# EAGLE design BSB-to-Wifi (EAGLE 6.6.0)
REVISION: v1.1

## Sheet 1 of 3
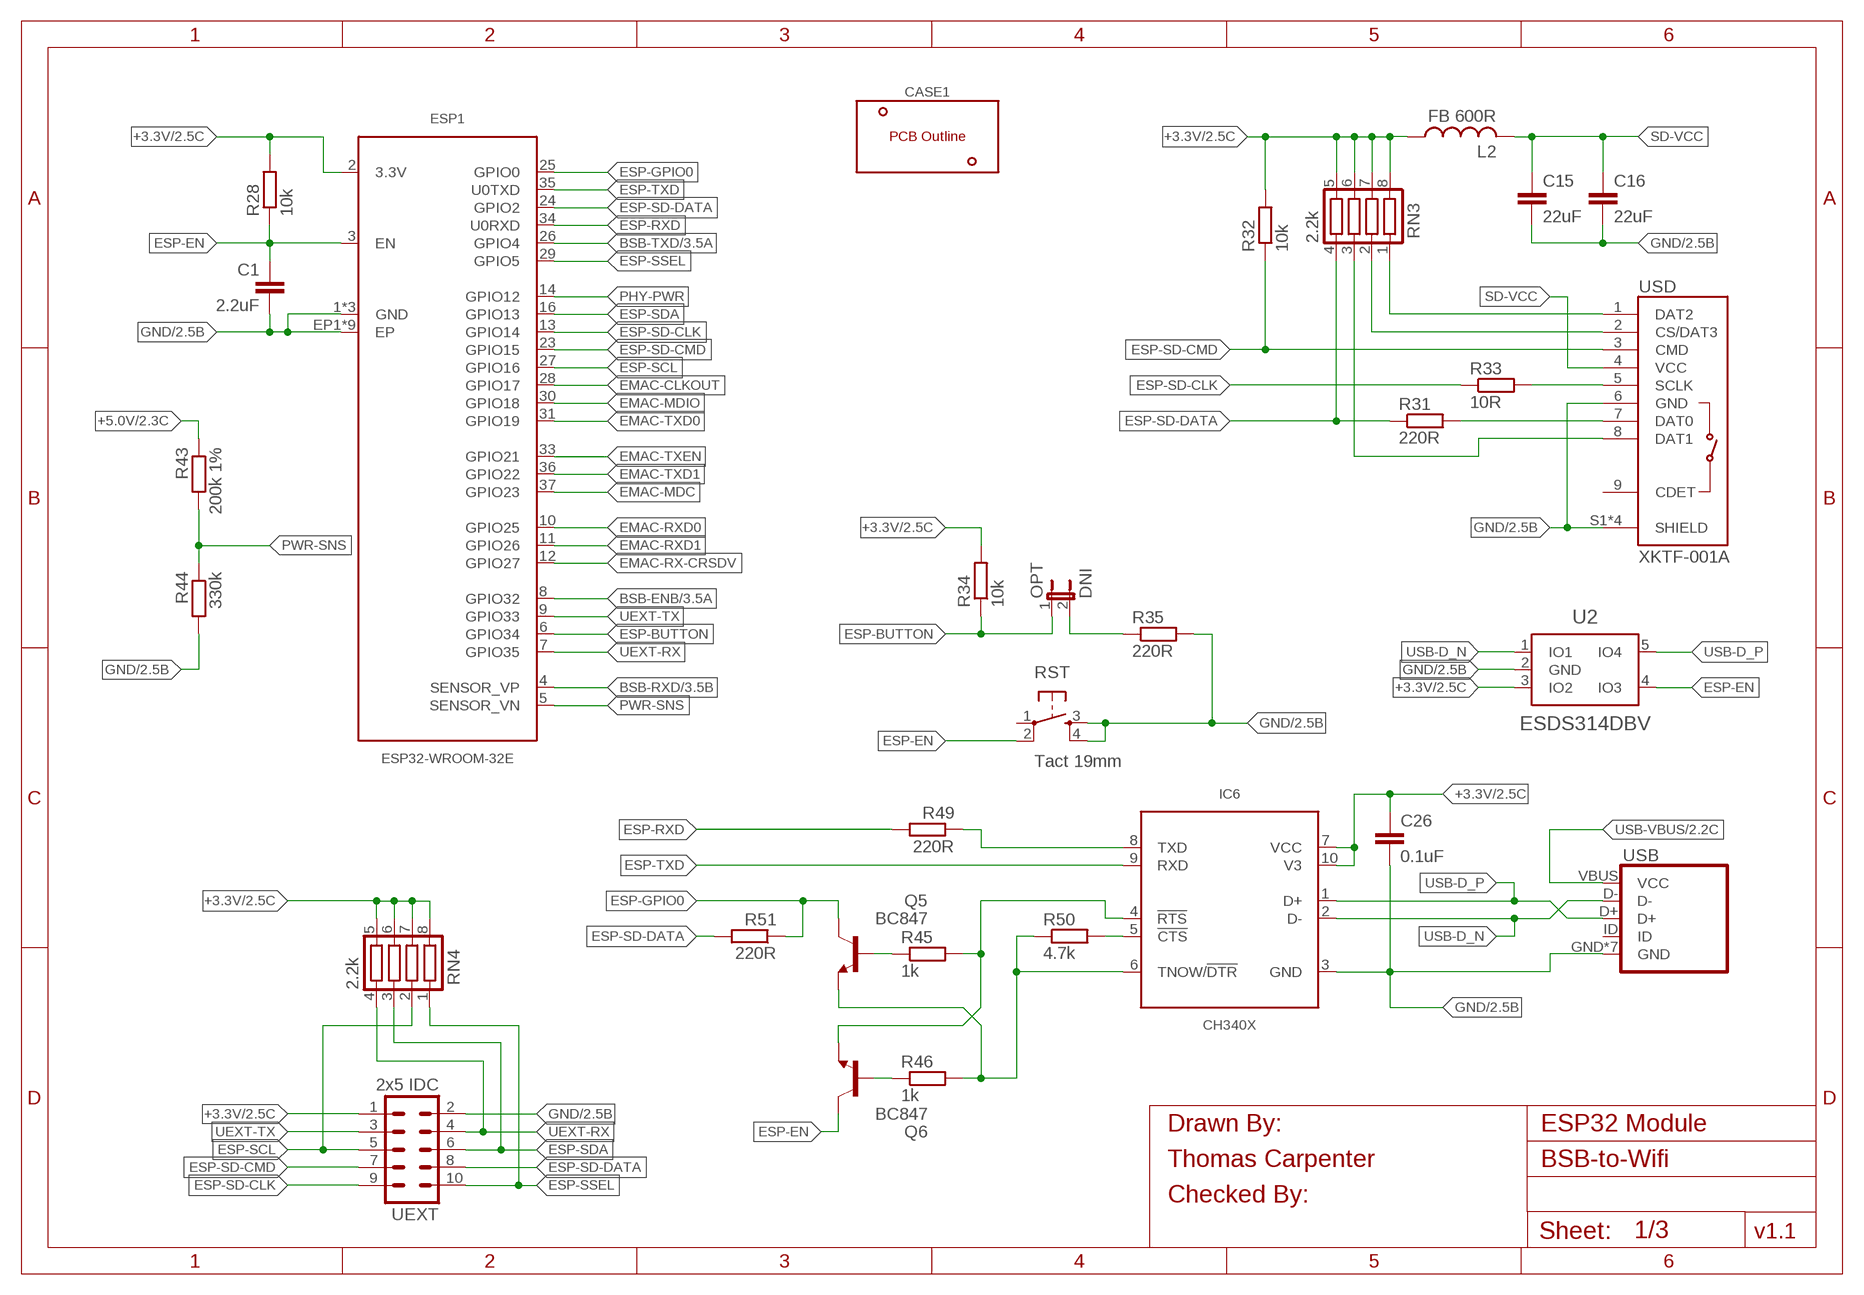
[diagram p0: schematic, sheet 1]
FRAME4 (A4L-LOC): DRAWN_BY: Thomas Carpenter; SHEET_NAME: ESP32 Module

### Parts
C1  2.2uF  C-EUC0603  [C0603]
C15  22uF  C-EUC0805L  [C0805L]
C16  22uF  C-EUC0805L  [C0805L]
C26  0.1uF  C-EUC0402  [C0402]
CASE1  DNI  CNMB/2  [CNMB/2-]
ESP1  ESP32-WROOM-32E  [ESP32-WROOM-32E]
IC6  CH340X  [MSOP10]
L2  FB 600R  L-USL0805  [L2010]
OPT  DNI  JUMPER-2-PTH  [1X02]
Q5  BC847  [SOT23]
Q6  BC847  [SOT23]
R28  10k  R-EU_R0402  [R0402]
R31  220R  R-EU_R0402  [R0402]
R32  10k  R-EU_R0402  [R0402]
R33  10R  R-EU_R0603L  [R0603L]
R34  10k  R-EU_R0402  [R0402]
R35  220R  R-EU_R0402  [R0402]
R43  200k 1%  R-EU_R0402  [R0402]
R44  330k  R-EU_R0603L  [R0603L]
R45  1k  R-EU_R0402  [R0402]
R46  1k  R-EU_R0402  [R0402]
R49  220R  R-EU_R0402  [R0402]
R50  4.7k  R-EU_R0402  [R0402]
R51  220R  R-EU_R0402  [R0402]
RN3  2.2k  R-NET-04-R1206  [CTS742C083]
RN4  2.2k  R-NET-04-R1206  [CTS742C083]
RST  Tact 19mm  SWITCH-MOMENTARY  [TACTILE_SWITCH]
U2  ESDS314DBV  [DBV0005A-SOT23]
UEXT  2x5 IDC  ML10  [ML10]
USB  ZX62-B-5PA(33)  USB_MICROB_PLUG  [USB-MICROB]
USD  XKTF-001A  MICROSD  [MICRO-SD]

### Nets
+3.3V [ESP32]: C26.1 ESP1.2(3.3V) IC6.7(VCC) IC6.10(V3) L2.1 R28.2 R32.2 R34.2 RN3.5 RN3.6 RN3.7 RN3.8 RN4.5 RN4.6 RN4.7 RN4.8 U2.3(IO2) UEXT.1 ; also sheet 2,3
+5.0V [ESP32]: R43.1 ; also sheet 2
BSB-ENB: ESP1.8(GPIO32) ; also sheet 3
BSB-RXD [ESP32]: ESP1.4(SENSOR_VP) ; also sheet 3
BSB-TXD [ESP32]: ESP1.26(GPIO4) ; also sheet 3
CH340-!CTS [ESP32]: IC6.5(!CTS) R50.2
CH340-!DTR [ESP32]: IC6.6(TNOW/!DTR) Q5.2(E) R46.2 R50.1
CH340-!RTS [ESP32]: IC6.4(!RTS) Q6.2(E) R45.2
CH340-TXD [ESP32]: IC6.8(TXD) R49.1
EMAC-CLKOUT [ESP32]: ESP1.28(GPIO17)
EMAC-MDC [ESP32]: ESP1.37(GPIO23)
EMAC-MDIO [ESP32]: ESP1.30(GPIO18)
EMAC-RX-CRSDV [ESP32]: ESP1.12(GPIO27)
EMAC-RXD0 [ESP32]: ESP1.10(GPIO25)
EMAC-RXD1 [ESP32]: ESP1.11(GPIO26)
EMAC-TXD0 [ESP32]: ESP1.31(GPIO19)
EMAC-TXD1 [ESP32]: ESP1.36(GPIO22)
EMAC-TXEN [ESP32]: ESP1.33(GPIO21)
ESP-BUTTON [ESP32]: ESP1.6(GPIO34) OPT.1 R34.1
ESP-BUTTON-R [ESP32]: OPT.2 R35.1
ESP-EN [ESP32]: C1.1 ESP1.3(EN) Q6.3(C) R28.1 RST.2 U2.4(IO3)
ESP-EN-OE [ESP32]: Q6.1(B) R46.1
ESP-GPIO0 [ESP32]: ESP1.25(GPIO0) Q5.3(C) R51.1
ESP-GPIO0-OE [ESP32]: Q5.1(B) R45.1
ESP-RXD [ESP32]: ESP1.34(U0RXD) R49.2
ESP-SCL [ESP32]: ESP1.27(GPIO16) RN4.2 UEXT.5
ESP-SD-CLK [ESP32]: ESP1.13(GPIO14) R33.1 UEXT.9
ESP-SD-CMD [ESP32]: ESP1.23(GPIO15) R32.1 UEXT.7 USD.3(CMD)
ESP-SD-DATA [ESP32]: ESP1.24(GPIO2) R31.1 R51.2 RN3.4 UEXT.8
ESP-SDA [ESP32]: ESP1.16(GPIO13) RN4.3 UEXT.6
ESP-SSEL [ESP32]: ESP1.29(GPIO5) RN4.1 UEXT.10
ESP-TXD [ESP32]: ESP1.35(U0TXD) IC6.9(RXD)
GND [ESP32]: C1.2 C15.2 C16.2 C26.2 ESP1.1(GND) ESP1.15(GND) ESP1.38(GND) ESP1.EP1(EP) ESP1.EP2(EP) ESP1.EP3(EP) ESP1.EP4(EP) ESP1.EP5(EP) ESP1.EP6(EP) ESP1.EP7(EP) ESP1.EP8(EP) ESP1.EP9(EP) IC6.3(GND) R35.2 R44.2 RST.3 RST.4 U2.2(GND) UEXT.2 USB.GND USB.MT1(GND) USB.MT2(GND) USB.MT3(GND) USB.MT4(GND) USB.MT5(GND) USB.MT6(GND) USD.6(GND) USD.S1(SHIELD) USD.S2(SHIELD) USD.S3(SHIELD) USD.S4(SHIELD) ; also sheet 2,3
PHY-PWR [ESP32]: ESP1.14(GPIO12)
PWR-SNS [ESP32]: ESP1.5(SENSOR_VN) R43.2 R44.1
SD-DAT0 [ESP32]: R31.2 USD.7(DAT0)
SD-DAT1 [ESP32]: RN3.3 USD.8(DAT1)
SD-DAT2 [ESP32]: RN3.1 USD.1(DAT2)
SD-DAT3 [ESP32]: RN3.2 USD.2(CS/DAT3)
SD-SCLK [ESP32]: R33.2 USD.5(SCLK)
SD-VCC [ESP32]: C15.1 C16.1 L2.2 USD.4(VCC)
UEXT-RX: ESP1.7(GPIO35) RN4.4 UEXT.4
UEXT-TX [ESP32]: ESP1.9(GPIO33) UEXT.3
USB-D_N [100R]: IC6.2(D-) U2.1(IO1) USB.D-
USB-D_P [100R]: IC6.1(D+) U2.5(IO4) USB.D+
USB-VBUS [ESP32]: USB.VBUS(VCC) ; also sheet 2
Unconnected: RST.1 USB.ID USD.9(CDET)

## Sheet 2 of 3
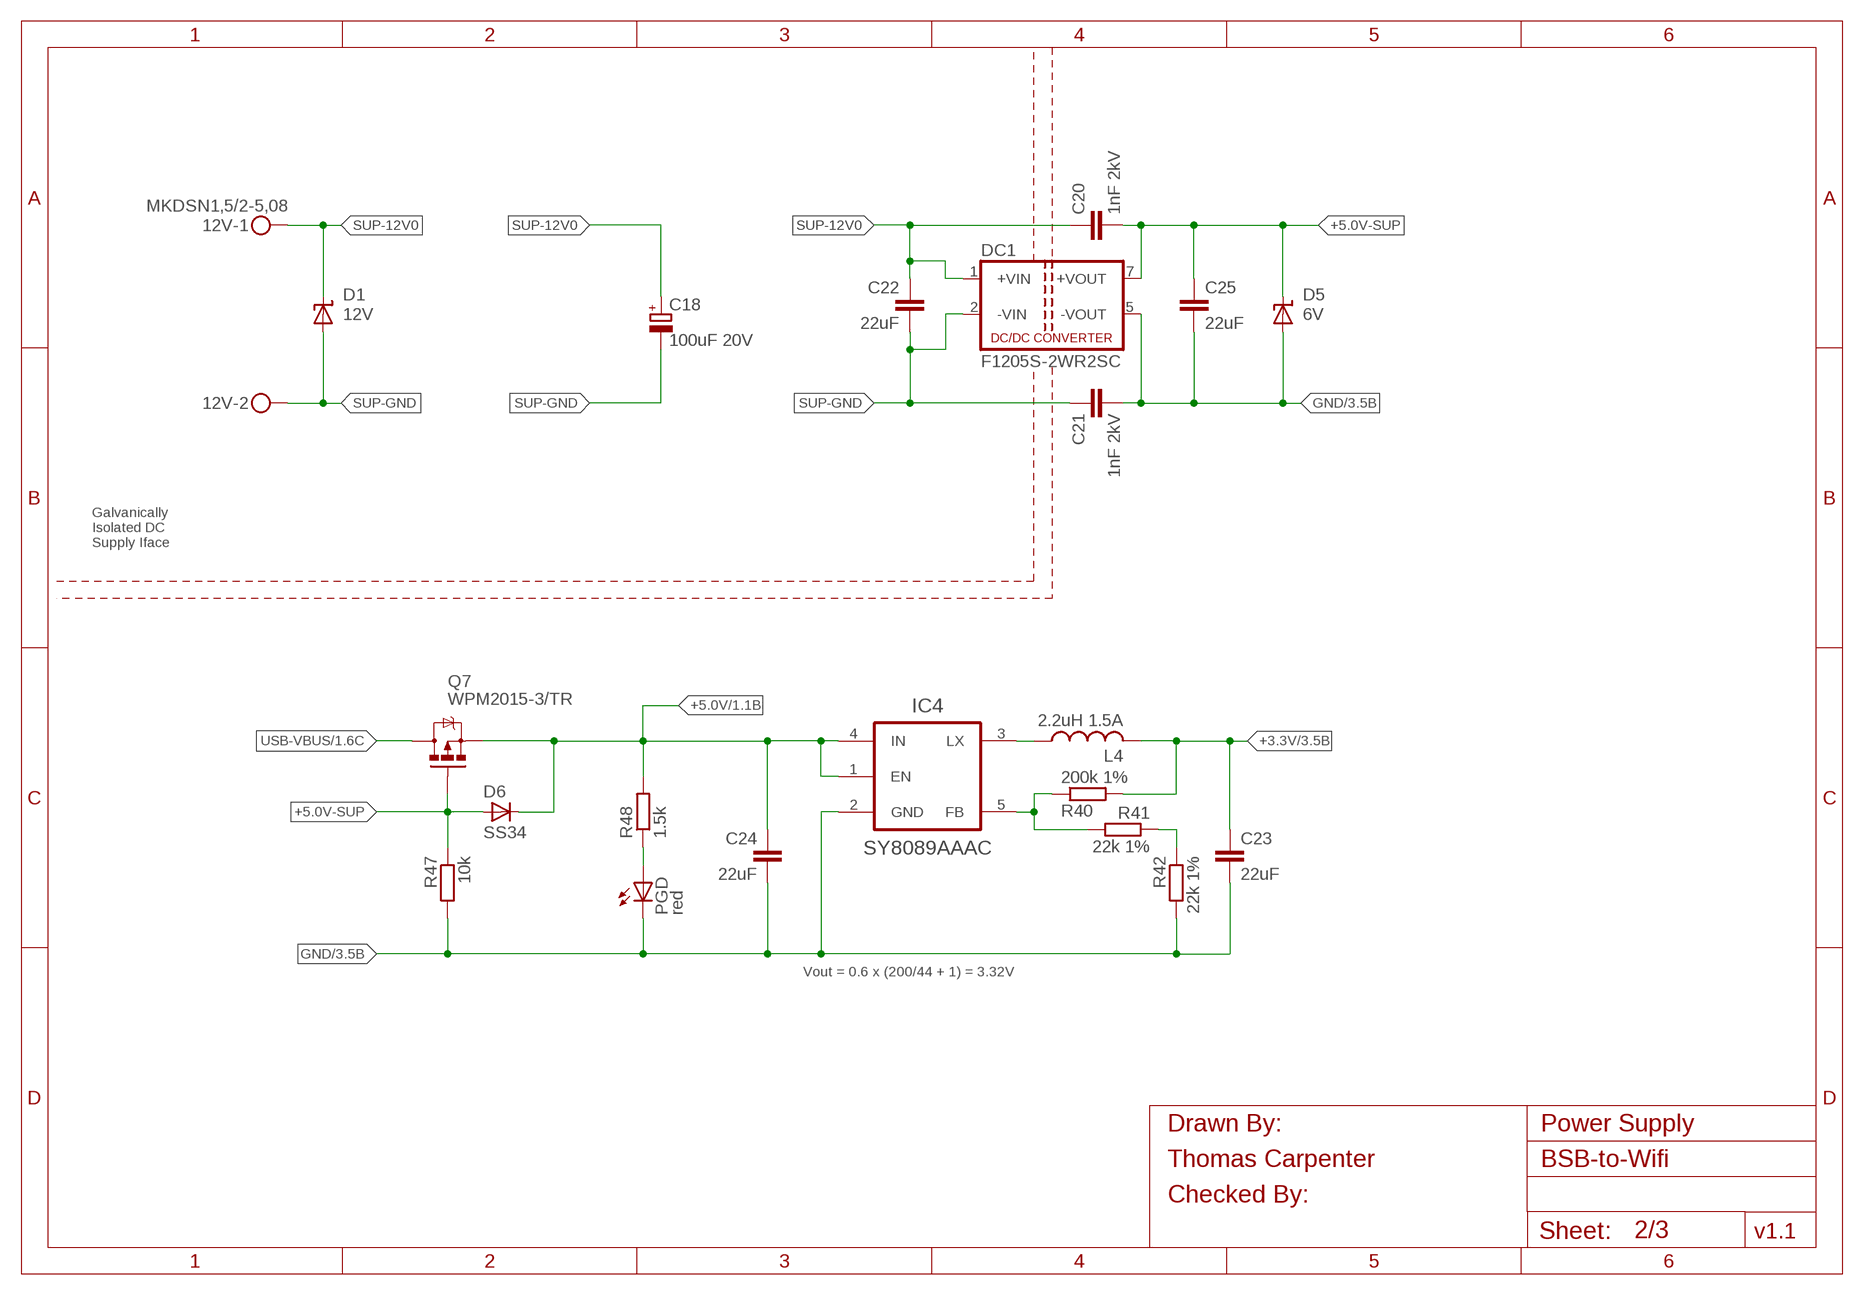
[diagram p1: schematic, sheet 2]
FRAME3 (A4L-LOC): DRAWN_BY: Thomas Carpenter; SHEET_NAME: Power Supply

### Parts
12V  MKDSN1,5/2-5,08  [MKDSN1_5-2-5_08]
C18  100uF 20V  CPOL-EUSMCD  [SMC_D]
C20  1nF 2kV  C-EUC1206L  [C1206L]
C21  1nF 2kV  C-EUC1206L  [C1206L]
C22  22uF  C-EUC0805  [C0805]
C23  22uF  C-EUC0805  [C0805]
C24  22uF  C-EUC0805  [C0805]
C25  22uF  C-EUC0805  [C0805]
D1  12V  TVS-UNISMA  [SMA]
D5  6V  TVS-UNISMA  [SMA]
D6  SS34  DIODE-SMA  [SMA]
DC1  F1205S-2WR2SC  [SIP7-N]
IC4  SY8089AAAC  [DBV0005A-SOT23]
L4  2.2uH 1.5A  L-USL4040P  [L4040P]
PGD  red  LEDCHIPLED_0603  [CHIP-LED0603]
Q7  WPM2015-3/TR  [SOT23]
R40  200k 1%  R-EU_R0402  [R0402]
R41  22k 1%  R-EU_R0402  [R0402]
R42  22k 1%  R-EU_R0402  [R0402]
R47  10k  R-EU_R0402  [R0402]
R48  1.5k  R-EU_R0603  [R0603]

### Nets
3V3-FB [ESP32]: IC4.5(FB) R40.1 R41.2
3V3-FB-RB [ESP32]: R41.1 R42.1
3V3-LX [ESP32]: IC4.3(LX) L4.1
+3.3V [ESP32]: C23.1 L4.2 R40.2 ; also sheet 1,3
+5.0V [ESP32]: C24.1 D6.C IC4.1(EN) IC4.4(IN) Q7.2(S) R48.2 ; also sheet 1
+5.0V-SUP [ESP32]: C20.2 C25.1 D5.C D6.A DC1.7(+VOUT) Q7.1(G) R47.1
GND [ESP32]: C21.2 C23.2 C24.2 C25.2 D5.A DC1.5(-VOUT) IC4.2(GND) PGD.C R42.2 R47.2 ; also sheet 1,3
PWR-LED [ESP32]: PGD.A R48.1
SUP-12V0 [PoE-ISO]: 12V.1 C18.+ C20.1 C22.1 D1.C DC1.1(+VIN)
SUP-GND [PoE-ISO]: 12V.2 C18.- C21.1 C22.2 D1.A DC1.2(-VIN)
USB-VBUS [ESP32]: Q7.3(D) ; also sheet 1

### Notes on the sheet
- Galvanically
  Isolated DC
  Supply Iface
- Vout = 0.6 x (200/44 + 1) = 3.32V

## Sheet 3 of 3
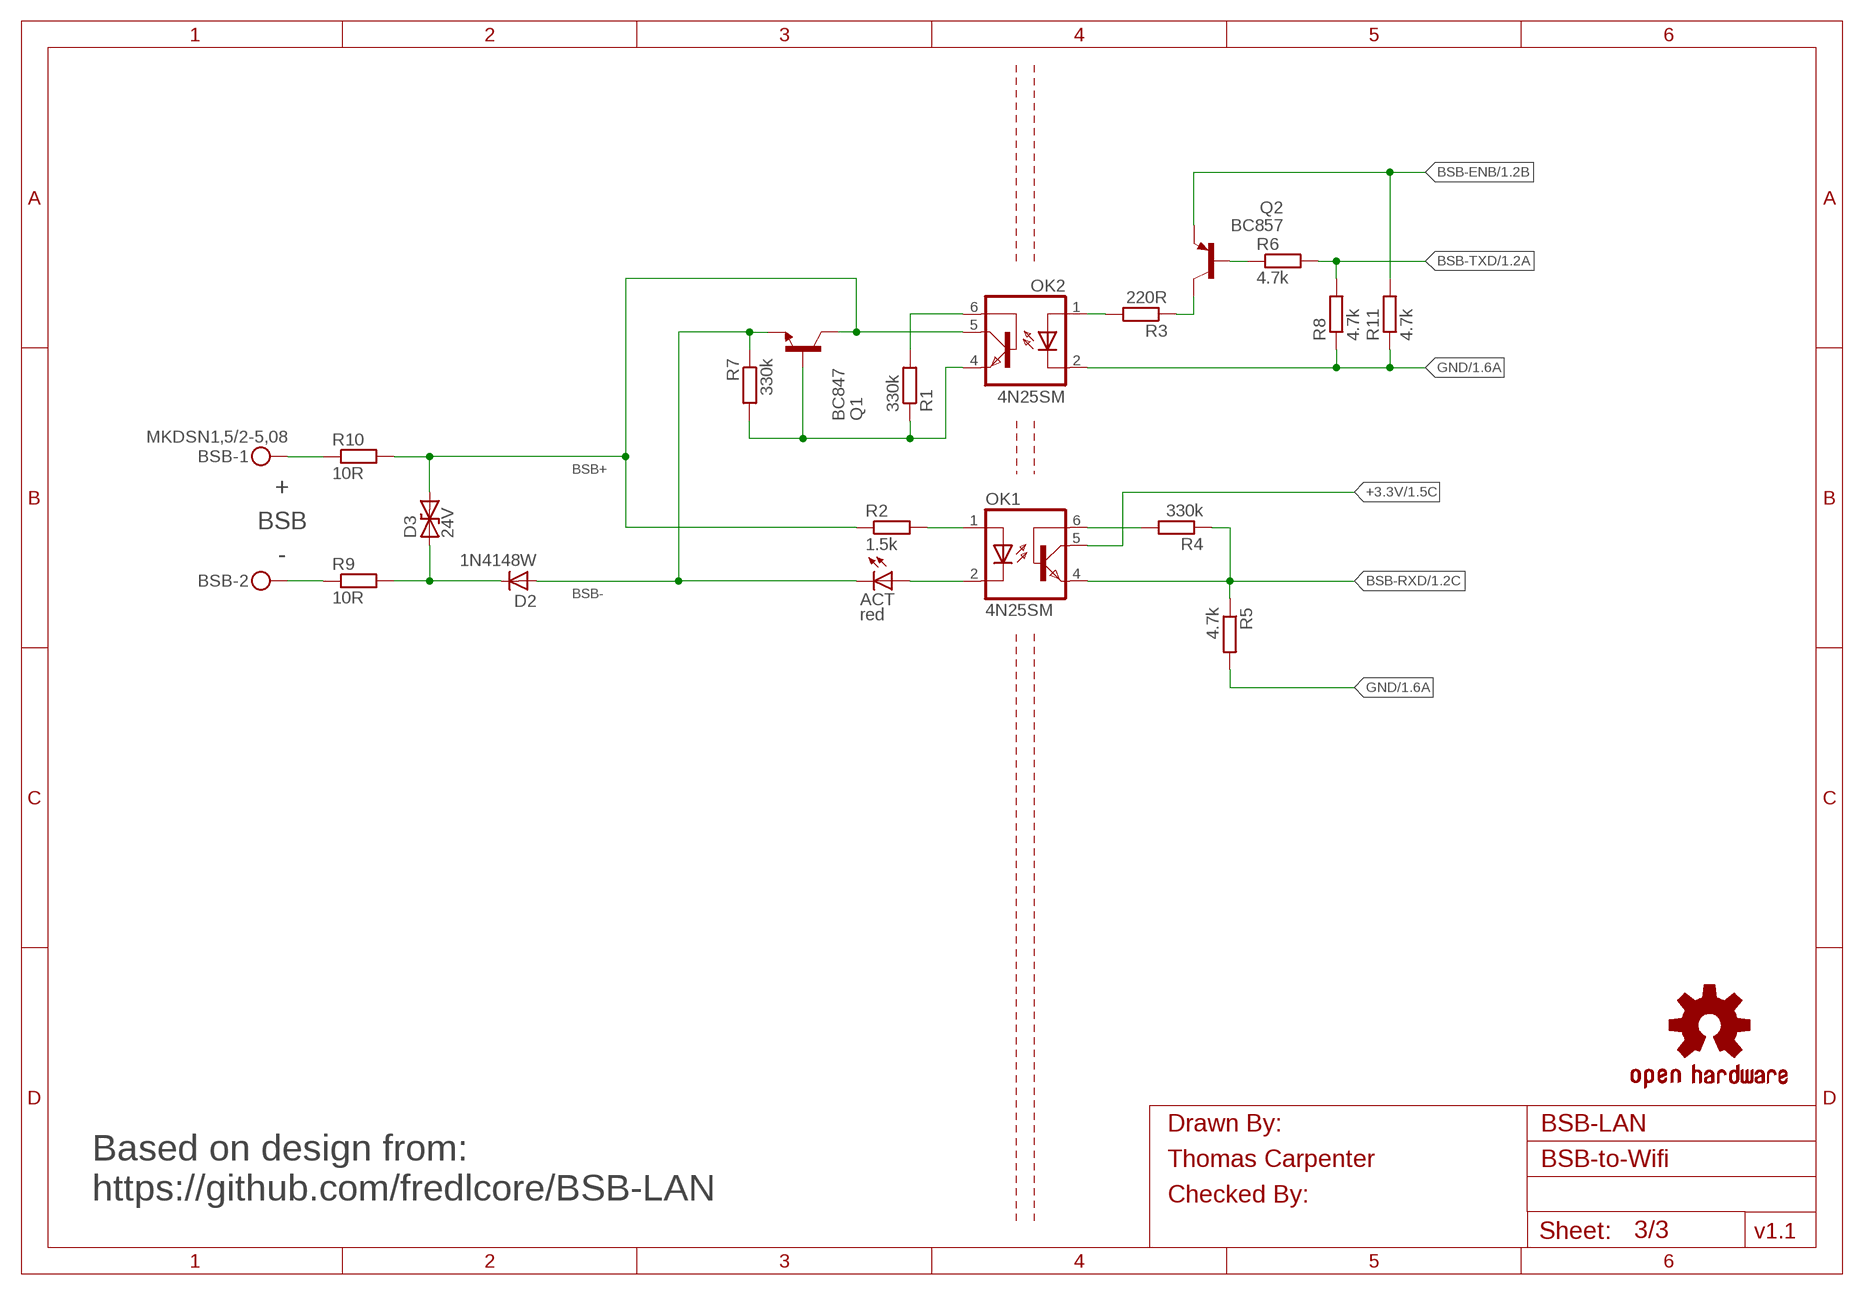
[diagram p2: schematic, sheet 3]
FRAME1 (A4L-LOC): DRAWN_BY: Thomas Carpenter; SHEET_NAME: BSB-LAN

### Parts
ACT  red  LEDCHIPLED_0603  [CHIP-LED0603]
BSB  MKDSN1,5/2-5,08  [MKDSN1_5-2-5_08]
D2  1N4148W  DIODE-SOD123  [SOD123]
D3  24V  TVS-BIDIRSMB  [SMBG]
OK1  4N25SM  [DIL6-SMD]
OK2  4N25SM  [DIL6-SMD]
Q1  BC847  [SOT23]
Q2  BC857  [SOT23-BEC]
R1  330k  R-EU_R0603  [R0603]
R2  1.5k  R-EU_R0603  [R0603]
R3  220R  R-EU_R0402  [R0402]
R4  330k  R-EU_R0603  [R0603]
R5  4.7k  R-EU_R0402  [R0402]
R6  4.7k  R-EU_R0402  [R0402]
R7  330k  R-EU_R0603  [R0603]
R8  4.7k  R-EU_R0402  [R0402]
R9  10R  R-EU_R0603  [R0603]
R10  10R  R-EU_R0603  [R0603]
R11  4.7k  R-EU_R0402  [R0402]
U$3  DNI  OSHW-LOGOM  [OSHW-LOGO-M]

### Nets
+3.3V [ESP32]: OK1.5(COL) ; also sheet 1,2
BSB+ [B2B-ISO]: D3.2 OK2.5(COL) Q1.3(C) R2.1 R10.2
BSB- [B2B-ISO]: ACT.C D2.A Q1.2(E) R7.1
BSB-ENB: Q2.E R11.2 ; also sheet 1
BSB-RX-A [B2B-ISO]: OK1.1(A) R2.2
BSB-RX-K [B2B-ISO]: ACT.A OK1.2(C)
BSB-RXD [ESP32]: OK1.4(EMI) R4.1 R5.1 ; also sheet 1
BSB-TX-B [B2B-ISO]: OK2.6(BAS) R1.2
BSB-TX-E [B2B-ISO]: OK2.4(EMI) Q1.1(B) R1.1 R7.2
BSB-TXD [ESP32]: R6.2 R8.2 ; also sheet 1
CON-BSB+ [B2B-ISO]: BSB.1 R10.1
CON-BSB- [B2B-ISO]: BSB.2 R9.1
GND [ESP32]: OK2.2(C) R5.2 R8.1 R11.1 ; also sheet 1,2
RXD-B [ESP32]: OK1.6(BAS) R4.2
TVS-BSB- [B2B-ISO]: D2.C D3.1 R9.2
TXD-A [ESP32]: OK2.1(A) R3.2
TXD-B [ESP32]: Q2.B R6.1
TXD-C [ESP32]: Q2.C R3.1

### Notes on the sheet
- +
  BSB
  -
- Based on design from:
  https://github.com/fredlcore/BSB-LAN

## Library data of the parts
12V BSB = BSB-LAN:MKDSN1,5/2-5,08: MKDSN 1,5/ 2-5,08 Printklemme Nennstrom: 13,5 A Nennspannung: 250 V Rastermaß: 5,08 mm Polzahl: 2 Anschlussart: Schraubanschluss Montage: Löten Anschlussrichtung Leiter/Platine: 0 ° Artikelnummer: 1729128 Source: http://eshop.phoenixcontact.com .. 1729128.pdf; LCSC_PART: C5183989
ACT PGD = BSB-LAN:LED: LED OSRAM: - CHIPLED LG R971, LG N971, LY N971, LG Q971, LY Q971, LO R971, LY R971 LH N974, LH R974 LS Q976, LO Q976, LY Q976 LO Q996 - Hyper CHIPLED LW Q18S LB Q993, LB Q99A, LB R99A - SideLED LS A670, LO A670, LY A670, LG A670, LP A670 LB A673, LV A673, LT A673, LW A673 LH A674 LY A675 LS A676, LA A676, LO A676, LY A676, LW A676 LS A679, LY A679, LG A679 - Hyper Micro SIDELED® LS Y876, LA Y876, LO Y876, LY Y876 LT Y87S - SmartLED LW L88C, LW L88S LB L89C, LB L89S, LG L890 LS L89K, LO L89K, LY L89K LS L896, LA L896, LO L896, LY L896 - TOPLED LS T670, LO T670, LY T670, LG T670, LP T670 LSG T670, LSP T670, LSY T670, LOP T670, LYG T670 LG T671, LOG T671, LSG T671 LB T673, LV T673, LT T673, LW T673 LH T674 LS T676, LA T676, LO T676, LY T676, LB T676, LH T676, LSB T676, LW T676 LB T67C, LV T67C, LT T67C, LS T67K, LO T67K, LY T67K, LW E67C LS E67B, LA E67B, LO E67B, LY E67B, LB E67C, LV E67C, LT E67C LW T67C LS T679, LY T679, LG T679 LS T770, LO T770, LY T770, LG T770, LP T770 LB T773, LV T773, LT T773, LW T773 LH T774 LS E675, LA E675, LY E675, LS T675 LS T776, LA T776, LO T776, LY T776, LB T776 LHGB T686 LT T68C, LB T68C - Hyper Mini TOPLED® LB M676 - Mini TOPLED Santana® LG M470 LS M47K, LO M47K, LY M47K Source: http://www.osram.convergy.de LUXEON: - LUMILED® LXK2-PW12-R00, LXK2-PW12-S00, LXK2-PW14-U00, LXK2-PW14-V00 LXK2-PM12-R00, LXK2-PM12-S00, LXK2-PM14-U00 LXK2-PE12-Q00, LXK2-PE12-R00, LXK2-PE12-S00, LXK2-PE14-T00, LXK2-PE14-U00 LXK2-PB12-K00, LXK2-PB12-L00, LXK2-PB12-M00, LXK2-PB14-N00, LXK2-PB14-P00, LXK2-PB14-Q00 LXK2-PR12-L00, LXK2-PR12-M00, LXK2-PR14-Q00, LXK2-PR14-R00 LXK2-PD12-Q00, LXK2-PD12-R00, LXK2-PD12-S00 LXK2-PH12-R00, LXK2-PH12-S00 LXK2-PL12-P00, LXK2-PL12-Q00, LXK2-PL12-R00 Source: www.luxeon.com KINGBRIGHT: KA-3528ASYC Source: www.kingbright.com; JLC_ROT: 270; LCSC_PART: C2286
C1 = BSB-LAN:C-EU: CAPACITOR, European symbol; LCSC_PART: C23630
C15 C16 C22-C25 = BSB-LAN:C-EU: CAPACITOR, European symbol; LCSC_PART: C45783
C18 = BSB-LAN:CPOL-EU: POLARIZED CAPACITOR, European symbol; LCSC_PART: C7224
C20 C21 = BSB-LAN:C-EU: CAPACITOR, European symbol; LCSC_PART: C9196
C26 = BSB-LAN:C-EU: CAPACITOR, European symbol; LCSC_PART: C1525
CASE1 = BSB-LAN:CNMB
D1 = BSB-LAN:TVS-UNI: Suppressor diode; LCSC_PART: C148213
D2 = BSB-LAN:DIODE-: DIODE; LCSC_PART: C81598
D3 = BSB-LAN:TVS-BIDIR: Bidirectional TVS Suppressor Diode SMAJxx(C)A Voltage Suppressor - SMA Package (DO-214AC) SMBJxx(C)A Voltage Suppressor - SMB Package (DO-214AA) SMCJxx(C)A Voltage Suppressor - SMC Package (DO-214AB); LCSC_PART: C83268
D5 = BSB-LAN:TVS-UNI: Suppressor diode; LCSC_PART: C223993
D6 = BSB-LAN:DIODE-: DIODE; LCSC_PART: C8678
DC1 = BSB-LAN:F*S-2WR2: DC-DC CONVERTER; LCSC_PART: C5369565
ESP1 = BSB-LAN:ESP32-WROOM; JLC_ROT: 270; JLC_Y: 7.72; LCSC_PART: C701341
IC4 = BSB-LAN:SY8089*?C; JLC_ROT: 270; LCSC_PART: C78988
IC6 = BSB-LAN:CH340X; LCSC_PART: C3035748
L2 = BSB-LAN:L-US: INDUCTOR, American symbol; LCSC_PART: C1017
L4 = BSB-LAN:L-US: INDUCTOR, American symbol; LCSC_PART: C135262
OK1 OK2 = BSB-LAN:4N*?M: General Purpose 6-Pin Phototransistor Optocouplers Source: http://www.fairchildsemi.com/ds/4N/4N35-M.pdf; LCSC_PART: C258246
OPT = BSB-LAN:JUMPER-2: Jumper Basic 0.1" spaced jumper. Use with breakaway headers.
Q1 Q5 Q6 = BSB-LAN:BC847*: NPN Transistor; JLC_ROT: 270; LCSC_PART: C130417
Q2 = BSB-LAN:BC857*: PNP Transistror; JLC_ROT: 270; LCSC_PART: C426782
Q7 = BSB-LAN:WPM2015; JLC_ROT: 270; LCSC_PART: C7472861
R1 R4 R7 R44 = BSB-LAN:R-EU_: RESISTOR, European symbol; LCSC_PART: C23137
R2 R48 = BSB-LAN:R-EU_: RESISTOR, European symbol; LCSC_PART: C22843
R3 R31 R35 R49 R51 = BSB-LAN:R-EU_: RESISTOR, European symbol; LCSC_PART: C25091
R5 R6 R8 R11 R50 = BSB-LAN:R-EU_: RESISTOR, European symbol; LCSC_PART: C25900
R9 R10 R33 = BSB-LAN:R-EU_: RESISTOR, European symbol; LCSC_PART: C22859
R28 R32 R34 R47 = BSB-LAN:R-EU_: RESISTOR, European symbol; LCSC_PART: C25744
R40 R43 = BSB-LAN:R-EU_: RESISTOR, European symbol; LCSC_PART: C25764
R41 R42 = BSB-LAN:R-EU_: RESISTOR, European symbol; LCSC_PART: C25768
R45 R46 = BSB-LAN:R-EU_: RESISTOR, European symbol; LCSC_PART: C11702
RN3 RN4 = BSB-LAN:R-NET-04: Chip Resistor Array 4 Single Resistor Source: http://www.ctscorp.com/components/Datasheets/CTSChipArrayDs.pdf; JLC_ROT: 270; LCSC_PART: C414564
RST = BSB-LAN:SWITCH-MOMENTARY: Momentary Switch Button commonly used for reset or general input. Spark Fun Electronics SKU : COM-00097 Surface mount is FSMCTTR from TE Connectivity.; LCSC_PART: C2837529
U2 = BSB-LAN:ESDS314; LCSC_PART: C1847859
U$3 = BSB-LAN:OSHW-LOGO: Open Source Hardware Logo This logo indicates the piece of hardware it is found on incorporates a OSHW license and/or adheres to the definition of open source hardware found here: http://freedomdefined.org/OSHW
UEXT = BSB-LAN:ML10: HARTING; LCSC_PART: C5665
USB = BSB-LAN:USB_MICROB_PLUG; JLC_Y: 1.2; LCSC_PART: C132561
USD = BSB-LAN:MICROSD: microSD Socket Push-push type uSD socket with card detect switch.; JLC_X: 7.28; JLC_Y: -8.1; LCSC_PART: C381079

## Net classes
1 100R: width 0.175 mm, drill 0.25 mm, clearance 0.15 mm
2 PoE-ISO: clearance 1.7 mm to class 1
3 B2B-ISO: clearance 1.7 mm to class 1, clearance 1.7 mm to class 2
4 ESP32: clearance 1.7 mm to class 2, clearance 1.7 mm to class 3
5 Sheild: clearance 1.5 mm to class 1, clearance 1.7 mm to class 2, clearance 1.7 mm to class 3, clearance 1.5 mm to class 4

## Board
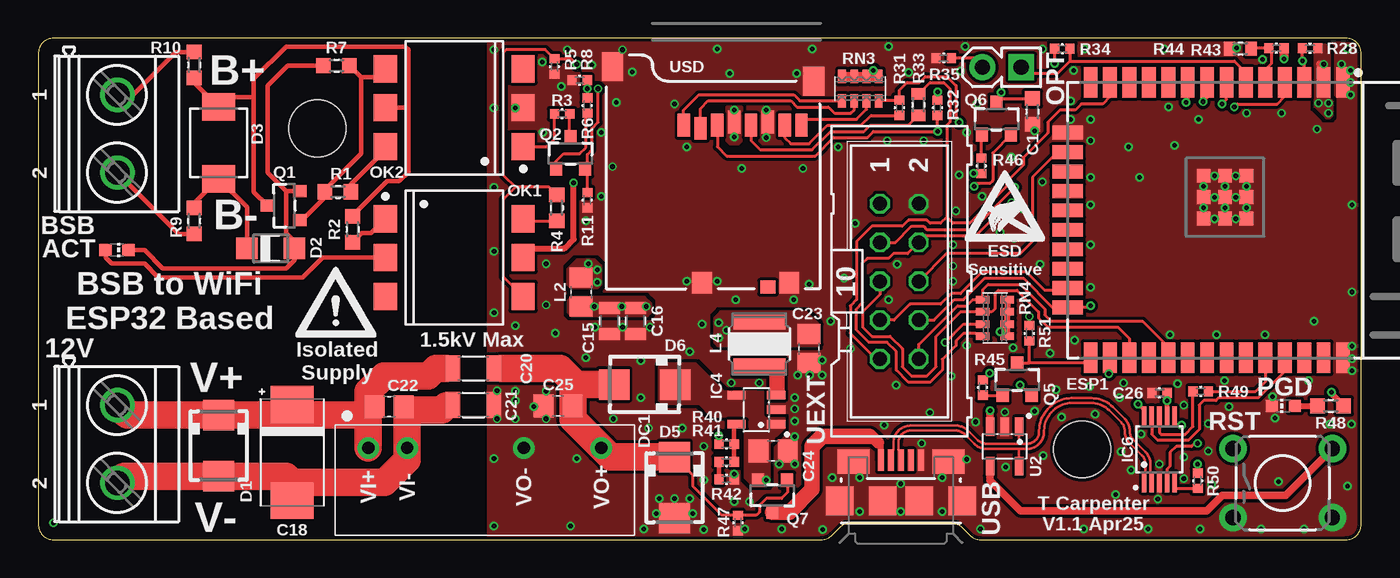
[diagram p3: board, top side]
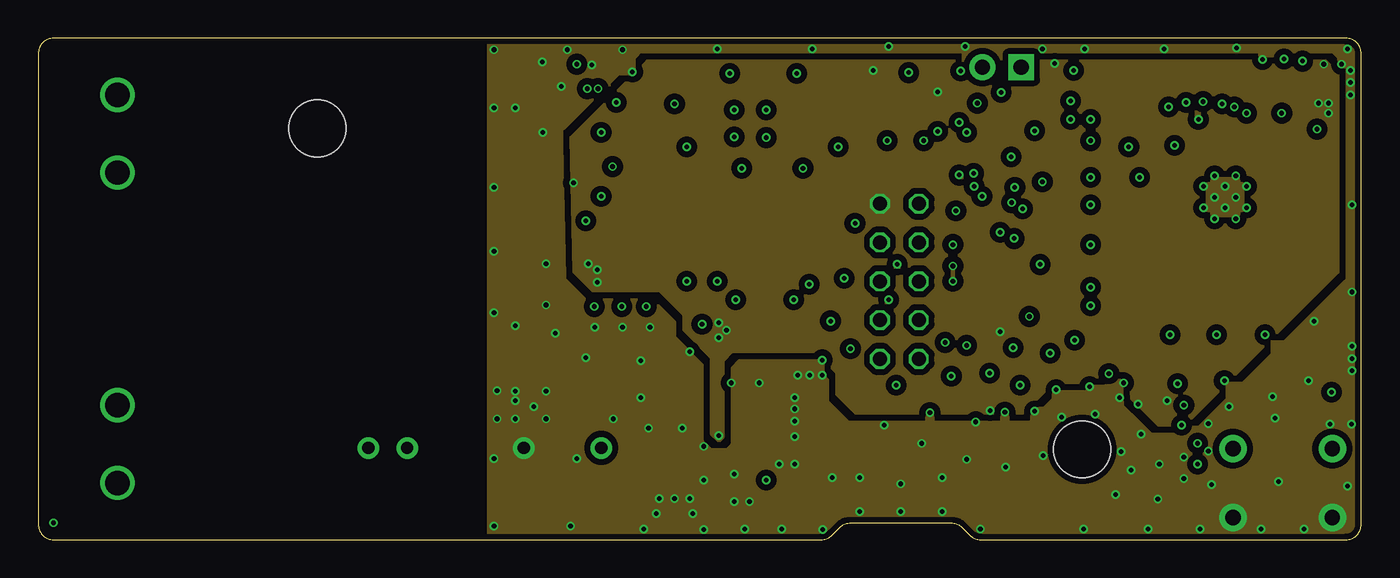
[diagram p4: board, inner layer Route2]
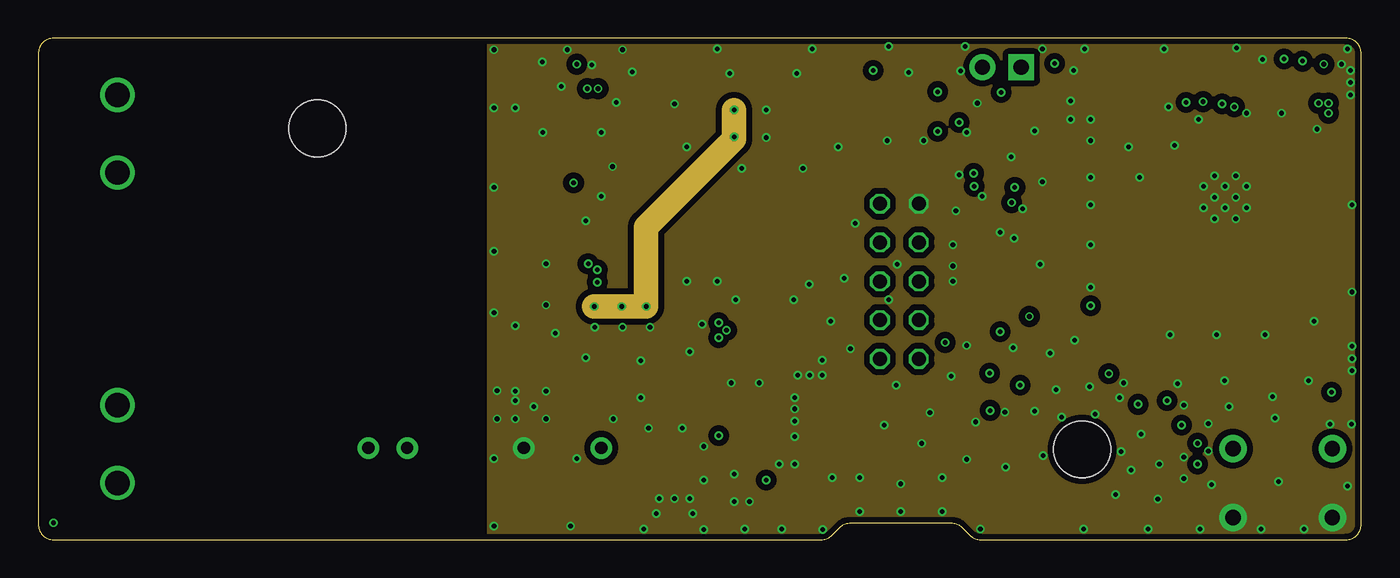
[diagram p5: board, inner layer Route15]
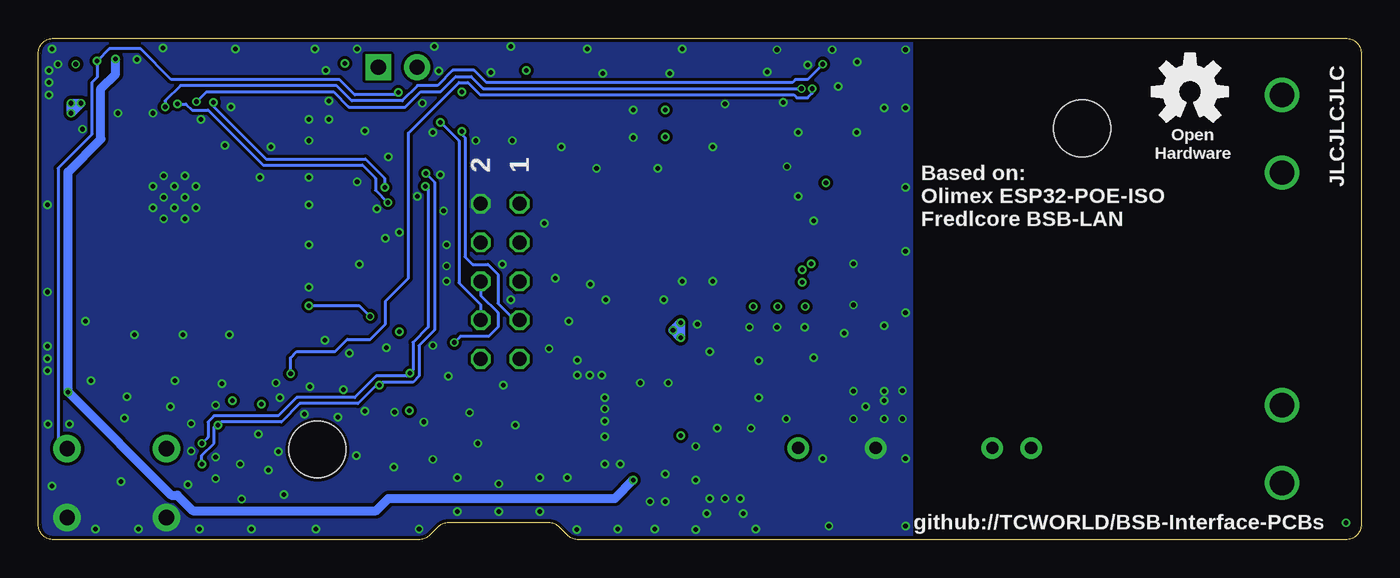
[diagram p6: board, bottom side, seen from below]

Size 86.5 x 32.8 mm. Coordinates in mm from the lower left corner, seen from the top.
Outline: 86.5,1 86.5,31.8 arc90 85.5,32.8 1,32.8 arc90 0,31.8 0,1 arc90 1,0 51.19,0 arc45 51.89,0.29 52.41,0.81 arc-45 53.11,1.1 59.69,1.1 arc-45 60.39,0.81 60.91,0.29 arc45 61.61,0 85.5,0 arc90 86.5,1
Copper layers (1+2*15+16): Top 0.035mm / dielectric 0.2mm / Route2 0.0175mm / dielectric 1.065mm / Route15 0.0175mm / dielectric 0.2mm / Bottom 0.035mm
Design rules "jlc4l-7628 *": minimum track width 0.12mm, minimum drill 0.2mm, track to track 0.125mm, track to pad 0.125mm, pad to pad 0.15mm, via to via 0.125mm, smd to smd 0mil, copper to edge 9mil, drill to drill 0.2mm, minimum pad ring 0.125mm, minimum via ring 0.125mm, stop-mask expansion 0.125mm, vias tented up to drill 1mm, thermal gap 6mil

### Footprints (pad centres in the part's own frame; a part is rotated, then mirrored left to right if it is on the bottom)
MKDSN1_5-2-5_08 = drill 1.6: 1 -2.54,0.025; 2 2.54,0.025
CHIP-LED0603 = smd 0.8 x 0.8: A 0,-0.75; C 0,0.75
C0603 = smd 0.95 x 1: 1 -0.85,0; 2 0.85,0
C0805L = smd 0.8 x 1.35: 1 -0.85,0; 2 0.85,0
SMC_D = smd 2.4 x 2.8: + -3.15,0; - 3.15,0
C1206L = smd 0.95 x 1.7: 1 -1.35,0; 2 1.35,0
C0805 = smd 1.3 x 1.5: 1 -0.95,0; 2 0.95,0
C0402 = smd 0.6 x 0.65: 1 -0.5,0; 2 0.5,0
CNMB/2- = hole 3.7: 18.25,27; 68.25,6
SMA = smd 2 x 2: A 2,0; C -2,0
SOD123 = smd 1.4 x 1.4: A 1.55,0; C -1.55,0
SMBG = smd 1.78 x 2.16: 1 -2.35,0; 2 2.35,0
SIP7-N = drill 0.8 pad 1.4: 1 -7.62,-0.5; 2 -5.08,-0.5; 5 2.54,-0.5; 7 7.62,-0.5
ESP32-WROOM-32E = smd 2 x 0.9: 1 -9,16.51; 2 -9,15.24; 3 -9,13.97; 4 -9,12.7; 5 -9,11.43; 6 -9,10.16; 7 -9,8.89; 8 -9,7.62; 9 -9,6.35; 10 -9,5.08; 11 -9,3.81; 12 -9,2.54; 13 -9,1.27; 14 -9,0; 25 9,0; 26 9,1.27; 27 9,2.54; 28 9,3.81; 29 9,5.08; 30 9,6.35; 31 9,7.62; 32 9,8.89; 33 9,10.16; 34 9,11.43; 35 9,12.7; 36 9,13.97; 37 9,15.24; 38 9,16.51 | smd 0.9 x 2: 15 -5.715,-1.5; 16 -4.445,-1.5; 17 -3.175,-1.5; 18 -1.905,-1.5; 19 -0.635,-1.5; 20 0.635,-1.5; 21 1.905,-1.5; 22 3.175,-1.5; 23 4.445,-1.5; 24 5.715,-1.5 | smd 0.9 x 0.9: EP1 -1.5,8.79; EP2 -1.5,10.19; EP3 -0.1,10.19; EP4 -0.1,8.79; EP5 -0.1,7.39; EP6 -1.5,7.39; EP7 -2.9,7.39; EP8 -2.9,8.79; EP9 -2.9,10.19
DBV0005A-SOT23 = smd 0.55 x 1.2: 1 -0.95,-1.3; 2 0,-1.3; 3 0.95,-1.3; 4 0.95,1.3; 5 -0.95,1.3
MSOP10 = smd 0.3 x 1.3: 1 -1,-2.15; 2 -0.5,-2.15; 3 0,-2.15; 4 0.5,-2.15; 5 1,-2.15; 6 1,2.15; 7 0.5,2.15; 8 0,2.15; 9 -0.5,2.15; 10 -1,2.15
L2010 = smd 1.3 x 1.5: 1 -0.95,0; 2 0.95,0
L4040P = smd 1.1 x 3.4: 1 -1.5,0; 2 1.5,0
DIL6-SMD = smd 1.78 x 1.52: 1 -2.54,-4.5; 2 0,-4.5; 3 2.54,-4.5; 4 2.54,4.5; 5 0,4.5; 6 -2.54,4.5
1X02 = drill 1 pad 1.676 square: 1 -1.27,0 | drill 1 pad 1.676: 2 1.27,0
SOT23 = smd 0.8 x 0.9: 1 -0.95,-1; 2 0.95,-1; 3 0,1.1
SOT23-BEC = smd 0.8 x 0.9: B -0.95,-1; C 0,1.1; E 0.95,-1
R0603 = smd 0.95 x 1: 1 -0.85,0; 2 0.85,0
R0402 = smd 0.6 x 0.65: 1 -0.5,0; 2 0.5,0
R0603L = smd 0.75 x 0.9: 1 -0.7,0; 2 0.7,0
CTS742C083 = smd 0.5 x 0.9: 1 -1.2,-0.8; 2 -0.4,-0.8; 3 0.4,-0.8; 4 1.2,-0.8; 5 1.2,0.8; 6 0.4,0.8; 7 -0.4,0.8; 8 -1.2,0.8
TACTILE_SWITCH = drill 1 pad 1.8: 1 -3.25,2.25; 2 3.25,2.25; 3 -3.25,-2.25; 4 3.25,-2.25
ML10 = drill 0.914 octagon: 1 -5.08,-1.27; 2 -5.08,1.27; 3 -2.54,-1.27; 4 -2.54,1.27; 5 0,-1.27; 6 0,1.27; 7 2.54,-1.27; 8 2.54,1.27; 9 5.08,-1.27; 10 5.08,1.27
USB-MICROB = smd 0.4 x 1.4: D+ 0,2.65; D- -0.65,2.65; GND 1.3,2.65; ID 0.65,2.65; VBUS -1.3,2.65 | smd 1.8 x 1.9: MT1 -4,0; MT2 4,0; MT5 -1.2,0; MT6 1.2,0 | smd 2.1 x 1.6: MT3 -3.1,2.55; MT4 3.1,2.55
MICRO-SD = smd 0.8 x 1.5: 1 5.35,-4.8; 2 6.45,-5; 3 7.55,-4.8; 4 8.65,-4.6; 5 9.75,-4.8; 6 10.85,-4.6; 7 11.95,-4.8; 8 13.05,-4.8 | smd 1 x 0.85: 9 10.86,-15.375 | smd 1.4 x 1.9: S1 0.7,-0.95; S2 13.85,-1.92 | smd 1.3 x 1.4: S3 6.55,-15.1; S4 12.25,-15.1

### Placement (x,y rotation side)
12V  5.15,6.25 270 top
ACT  5.15,18.95 270 top
BSB  5.15,26.55 270 top
C1  65,28 270 top
C15  37.35,14.3 270 top
C16  39.05,14.3 270 top
C18  16.6,5.7 270 top
C20  28.45,11.2 0 top
C21  28.45,8.8 0 top
C22  22.95,8.7 0 top
C23  50.4,12.5 270 top
C24  48.05,5.8 0 top
C25  34,8.75 180 top
C26  73.3,9.6 180 top
CASE1  0,-0.1 0 top
D1  11.8,6.15 270 top
D2  15.2,19.05 0 top
D3  11.8,25.95 90 top
D5  41.6,3.4 270 top
D6  39.65,10.15 180 top
DC1  29.2,6.5 0 top
ESP1  68.8,20.9 270 top
IC4  46.95,8.5 90 top
IC6  73.3,5.9 0 top
L2  35.5,16.2 270 top
L4  47.15,12.8 90 top
OK1  27.2,18.45 270 top
OK2  27.2,28.25 90 top
OPT  63,30.9 180 top
PGD  81.4,8.75 90 top
Q1  16.1,21.85 90 top
Q2  34.8,25.25 0 top
Q5  64,10.45 0 top
Q6  62.65,27.5 0 top
Q7  48,2.9 180 top
R1  19.6,22.75 0 top
R2  20.55,20.3 270 top
R3  34.25,27.85 180 top
R4  33.9,21.7 270 top
R5  33.75,30.95 270 top
R6  35.9,28.4 90 top
R7  19.5,31 0 top
R8  35.4,30.05 0 top
R9  10.2,20.85 90 top
R10  10.2,31.05 270 top
R11  35.9,22.2 90 top
R28  83.15,32.15 0 top
R31  56.3,28.25 270 top
R32  58.8,28.25 90 top
R33  57.55,28.45 270 top
R34  66.95,32.1 180 top
R35  59.2,31.5 180 top
R40  45,6.25 180 top
R41  45,5.1 0 top
R42  45,3.95 0 top
R43  80.95,32.15 180 top
R44  78.6,32.11 180 top
R45  61.75,9.95 90 top
R46  61.65,24.45 270 top
R47  45.75,1.1 270 top
R48  84.5,8.75 0 top
R49  76,9.7 0 top
R50  75.8,3.85 270 top
R51  64.8,13.5 90 top
RN3  53.75,29.5 0 top
RN4  62.55,14.5 270 top
RST  81.36,3.7 0 top
U2  63.18,6.1 180 top
U$1  [WARN-TINY]  19.45,15 0 top
U$2  [ESD-TINY]  63.2,21.3 0 top
U$3  11.2,29.3 0 bottom
UEXT  56.3,16.9 270 top
USB  56.4,2.55 0 top
USD  36.85,31.9 0 top

### Tracks (layer width: path | path; a pad name or v marks a point on that pad's centre or on a via)
3V3-FB
  Top 0.3: R40.1 R41.2 45.5,7.55 IC4.5
3V3-FB-RB
  Top 0.3: R41.1 R42.1
3V3-LX
  Top 0.55: IC4.3 48.3,9.45 48.3,9.7
  Top 1: 48.3,9.7 48.3,11.3 L4.1
+3.3V  (via drill 0.3)
  Top 0.2: IC6.10 72.3,8.45 v71.9,8.85 | R34.2 v66.45,31.15
  Top 0.3: R40.2 v44.5,6.8 | IC6.7 73.8,9.05
  Top 0.4: OK1.5 31.7,19.05 34.4,19.05 35,19.65 v35,23.35 | RN4.8 RN4.7 RN4.6 63.35,13.6 | 63.35,13.6 RN4.5 | v62.9,13.6 63.35,13.6
  Top 0.5: R32.2 v58.8,29.3 | 73.8,9.05 v73.8,9.1 C26.1 | U2.3 v62.23,8.45 | 83.8,31.1 v84.05,31.1
  Top 0.6: RN3.8 RN3.7 RN3.6 RN3.5 54.6,30.3 v54.6,30.7
  Bottom 0.6: v83.7,28.55 v84.35,27.9 v84.35,28.55 v83.7,28.55 | v44.5,14.2 v44.5,13.2 v45,13.7 v44.5,14.2
  other vias: 36.55,16.85 36.55,17.65 35.95,18.05
  pour Top (isolate 0.2, no thermals): 44.4,12.7 51,12.7 51,14.1 50.2,14.9 44.6,14.9 44.2,14.5 44.2,12.9
  pour Route2 (isolate 0.4, rank 4, no thermals): 85,30.5 84.2,31.3 39.8,31.3 34.8,26.3 35,17.5 36.2,16.3 40.6,16.3 42.2,14.7 42.2,13.7 44,11.9 44,6.9 44.4,6.5 44.6,6.5 44.8,6.7 44.8,11.7 45.4,12.3 50.8,12.3 52.2,10.9 52.2,9.5 53.4,8.3 64.4,8.3 66.4,10.3 70.4,10.3 73.2,7.5 75,7.5 85,17.5
  pour Top (isolate 0.2, no thermals): 84.6,27.75 84.6,28.65 84.45,28.8 84.45,32.05 84.15,32.35 83.45,32.35 83.45,28.35 84.2,27.6 84.45,27.6
  pour Top (isolate 0.2, no thermals): 36.8,16.7 36.8,17.9 36.4,18.3 35.2,18.3 34.6,17.7 34.6,16.7 34.8,16.5 36.6,16.5
+5.0V  (via drill 0.3)
  Top 0.4: R48.2 84.55,9.55 v84.55,9.65
  Top 0.6: R43.1 v81.45,31.45
  Bottom 0.6: v81.45,31.45 81.45,30.45 82.4,29.5 82.4,26.2 84.55,24.05 v84.55,9.65 77.8,2.9 77.4,2.9 76.4,1.9 64.4,1.9 63.6,2.7 48.8,2.7 v47.6,3.9
  pour Top (isolate 0.2, no thermals): 48.8,7.9 47.6,7.9 47.4,8.1 47.4,9.65 44.85,9.65 43,11.5 40.8,11.5 40.6,11.3 40.6,9.1 40.8,8.9 43.2,8.9 44,8.1 46,8.1 46.2,7.9 46.2,4.05 46.7,3.55 47.65,3.55 47.8,3.7 47.8,6.3 48.8,7.3
+5.0V-SUP
  Top 0.2: Q7.1 49,3.9 49,3.1 48.6,2.7 47.6,2.7 47.15,2.25 47.15,1.8 46.95,1.6 R47.1 44.7,1.6 42.8,3.5 42.8,4.2 D5.C 41.7,5.4
  Top 0.8: 30.3,11.2 C20.2
  Top 1.8: D5.C 37.42,5.4 DC1.7 34.95,7.87 C25.1 34.95,10.15 | 34.95,10.15 34.95,10.35 34.1,11.2 30.3,11.2 | D6.A 34.95,10.15
BSB+
  Top 0.3: R10.2 10.2,29.9 D3.2 11.8,28.95 14.1,28.95 | Q1.3 14.1,22.75 14.1,28.95 | 14.1,28.95 14.1,30.15 16.2,32.25 24,32.25 24.2,32.05 24.2,28.25 | 24.2,28.25 24.2,24.05 23.6,23.45 22.8,23.45 20.55,21.2 R2.1 | OK2.5 24.2,28.25
BSB-
  Top 0.3: ACT.C 6.95,18.95 8.15,17.75 16.2,17.75 16.75,18.3 D2.A 16.75,19.5 16.2,20.05 16.2,22.8 | 16.2,22.8 15,24 15,29.7 16.3,31 R7.1 | 16.2,22.8 Q1.2
BSB-ENB  (via drill 0.3)
  Top 0.2: ESP1.8 76.42,28.92 v76.15,28.65 | R11.2 35.9,24.25 | 35.9,24.25 Q2.E | 35.9,24.25 35.9,25.2 36.2,25.5 36.2,26.9 36.6,27.3 v36.6,29.5
  Bottom 0.2: v76.15,28.65 75.5,29.3 67.2,29.3 66.2,28.3 62.5,28.3 61.5,29.3 60.2,29.3 59.2,30.3 58.2,30.3 57.4,29.5 v36.6,29.5
BSB-RX-A
  Top 0.3: R2.2 21.15,20.05 21.76,20.05 OK1.1
BSB-RX-K
  Top 0.3: ACT.A 4.4,18.45 4.8,18.05 6.95,18.05 7.85,17.15 17.3,17.15 18.6,18.45 OK1.2
BSB-RXD  (via drill 0.3)
  Top 0.2: 31.2,23.05 30.4,23.85 30.4,31.85 30.6,32.05 33.15,32.05 R5.1 34.85,31.45 v35.2,31.1 | 31.2,23.05 30.4,22.25 30.4,17.21 OK1.4 | R4.1 33.4,23.05 31.2,23.05 | v78.2,28.3 78.4,28.5 81,28.5 81.5,29 ESP1.4
  Bottom 0.2: v35.2,31.1 36.2,30.1 37,30.1 37.2,29.9 57.2,29.9 58,30.7 59.4,30.7 60.4,29.7 61.7,29.7 62.7,28.7 66,28.7 67,29.7 77.2,29.7 78.2,28.7 v78.2,28.3
BSB-TX-B
  Top 0.3: R1.2 20.45,23.25 22.25,25.05 22.7,25.05 OK2.6
BSB-TX-E
  Top 0.3: 21.1,30.25 21.1,25.25 18.75,22.9 R1.1 18.75,22.4 17.25,20.9 Q1.1 | OK2.4 22.7,30.25 21.1,30.25 | R7.2 21.1,30.25
BSB-TXD  (via drill 0.3)
  Top 0.2: ESP1.26 70.07,10.92 v70,10.85 | R6.2 v35.9,29.5 R8.2
  Bottom 0.2: v70,10.85 70,11.9 69.6,12.3 67.1,12.3 66.3,13.1 64.8,13.1 63.8,14.1 63.8,15.6 62.3,17.1 62.3,26.6 59,29.9 58.4,29.9 57.6,29.1 37.1,29.1 36.9,28.9 36.2,28.9 35.9,29.2 v35.9,29.5
CH340-!CTS
  Top 0.2: IC6.5 74.3,3.35 R50.2
CH340-!DTR  (via drill 0.3)
  Top 0.2: R50.1 v75.8,4.95 | v74.75,7.5 74.3,7.5 IC6.6 | R46.2 v61.15,23.95 | v64.2,10.1 64.85,9.45 Q5.2
  Bottom 0.2: v75.8,4.95 75.8,5.5 75,6.3 75,7.35 74.85,7.5 v74.75,7.5 74.55,7.7 70.6,7.7 69.4,8.9 65.6,8.9 64.4,10.1 v64.2,10.1 64,10.3 62,10.3 61.6,10.7 61.6,12.7 60.6,13.7 60.6,23.4 v61.15,23.95
CH340-!RTS  (via drill 0.3)
  Top 0.2: Q6.2 62.4,25.3 62.4,23.5 62.2,23.3 61.4,23.3 v61.2,23.1 | v62.2,10.9 R45.2 | v75.8,6.3 75.6,6.3 75.4,6.1 74.4,6.1 74,5.7 74,4.8 73.8,4.6 IC6.4
  Bottom 0.2: v61.2,23.1 61,22.9 61,13.9 62,12.9 62,11.1 v62.2,10.9 62.4,10.7 64.4,10.7 65.8,9.3 69.6,9.3 70.8,8.1 75,8.1 75.4,7.7 75.4,6.7 v75.8,6.3
CH340-TXD
  Top 0.2: IC6.8 73.3,7 73.4,6.9 75,6.9 75.5,7.4 R49.1
CON-BSB+
  Top 0.3: R10.1 9.25,31.9 9,31.9 6.19,29.09 5.64,29.09 BSB.1
CON-BSB-
  Top 0.3: R9.1 9.19,20 BSB.2
ESP-BUTTON
  Top 0.2: ESP1.6 78.96,30.54 78.2,31.3 67.45,31.3 | OPT.1 64.27,30.5 66.65,30.5 67.45,31.3 | R34.1 67.45,31.3
ESP-BUTTON-R
  Top 0.2: OPT.2 61.73,31.5 R35.1
ESP-EN  (via drill 0.3)
  Top 0.2: ESP1.3 82.77,31.18 v82.65,31.3 R28.1 | Q6.3 62.8,28.6 62.8,28.85 62.95,28.85 | v62.95,29.25 62.95,28.85 | 62.95,28.85 C1.1
  Top 0.5: U2.4 62.23,3.87 64.2,1.9 76.4,1.9 77.4,2.9 81.56,2.9 RST.2
  Bottom 0.2: v62.95,29.25 63.1,29.1 65.8,29.1 66.8,30.1 77.8,30.1 79.8,32.1 81.85,32.1 v82.65,31.3 82.65,30.25 83,29.9 83,26.5 85.2,24.3 85.2,6.54 RST.2
ESP-EN-OE
  Top 0.2: R46.1 61.65,26.45 Q6.1
ESP-GPIO0
  Top 0.2: 68.8,12 ESP1.25 68.8,11.55 64.8,11.55 | Q5.3 64.8,11.55 | 64.8,11.55 R51.1
ESP-GPIO0-OE
  Top 0.2: R45.1 Q5.1
ESP-RXD
  Top 0.2: R49.2 79.6,9.7 80.23,10.33 ESP1.34
ESP-SCL
  Top 0.2: UEXT.5 55.03,16.03 53.9,14.9 53.9,13.9 54.5,13.3 55.7,13.3 56.5,12.5 56.5,11.3 57.1,10.7 58.1,10.7 58.7,11.3 58.7,13.3 60.3,14.9 RN4.2 62.35,14.9 62.55,15.1 62.55,16.1 62.75,16.3 64,16.3 65.4,14.9 65.4,14.5 66,13.9 70.6,13.9 71.34,13.16 ESP1.27
ESP-SD-CLK
  Top 0.2: ESP1.13 70.07,28.97 69.6,28.5 68.2,28.5 67.8,28.1 66.8,28.1 66,27.3 66,26.6 64.4,25 64.4,24.5 63.3,23.4 63.3,23.1 60.9,20.7 59.8,20.7 59.4,21.1 | 59.4,21.1 59,20.7 58.3,20.7 58.1,20.9 56.9,20.9 56.5,20.5 54.5,20.5 53.5,19.5 53.5,15.7 53.1,15.3 53.1,13.5 54.78,11.82 UEXT.9 | R33.1 58.3,29.9 59.2,29.9 59.6,29.5 59.6,27.3 59.4,27.1 59.4,21.1
ESP-SD-CMD  (via drill 0.3)
  Top 0.2: UEXT.7 55.96,14.36 57,15.4 59,15.4 59.7,16.1 60.3,16.1 61.7,17.5 64.6,17.5 65.8,16.3 67.3,16.3 ESP1.23 | USD.3 44.4,25.7 45,25.1 50.8,25.1 52,26.3 54.2,26.3 54.6,26.7 v58.8,26.7 R32.1
  Bottom 0.2: v58.8,26.7 58.8,26.5 58.6,26.3 58.6,18.5 58.1,18 57.1,18 56.45,17.35 56.45,15.45 55.36,14.36 UEXT.7
ESP-SD-DATA  (via drill 0.3)
  Top 0.2: UEXT.8 58.56,14.36 59.9,15.7 60.5,15.7 61.9,17.1 64.4,17.1 66.31,15.19 ESP1.24 68.69,15.19 v68.8,15.3 | RN3.4 54.95,28.75 R31.1 56.3,29.4 56.8,29.9 57.6,29.9 58,30.3 59.4,30.3 60,29.7 60,27.5 v60.2,27.3 | R51.2 v64.8,14.6
  Bottom 0.2: v60.2,27.3 59,26.1 59,16.8 | 59,16.79 59,16.8 | 59,16.8 57.57,15.37 UEXT.8 | v64.8,14.6 65.5,15.3 v68.8,15.3
ESP-SDA  (via drill 0.3)
  Top 0.2: ESP1.16 66.64,25.34 65,23.7 65,19.5 64.2,18.7 59.37,18.7 UEXT.6 | v59.3,12.9 60.5,14.1 RN4.3
  Bottom 0.2: UEXT.6 57.57,15.97 56.45,14.85 56.45,13.9 57.05,13.3 58.9,13.3 v59.3,12.9
ESP-SSEL
  Top 0.2: UEXT.10 57.57,12.77 60.1,15.3 60.7,15.3 61.1,15.7 RN4.1 61.75,16.35 62.1,16.7 64.2,16.7 65.8,15.1 65.8,14.7 66.2,14.3 72.2,14.3 73.88,12.62 ESP1.29
ESP-TXD
  Top 0.2: IC6.9 72.8,6.9 73.2,6.5 75.2,6.5 75.9,7.2 75.9,8.8 76.2,9.1 77,9.1 77.2,9.3 79.8,9.3 81.5,11 ESP1.35
ETH-SHLD  (via drill 0.3)
  other vias: 1,1.1
GND  (via drill 0.3)
  other vias: 76.2,23.1 77.6,23.1 79,23.1 79,21.7 77.6,21.7 76.2,21.7 76.9,21 78.3,21 78.3,23.8 78.3,22.4 76.9,22.4 76.9,23.8 30,9.75 30,7.9 33.2,7.9 57.75,6.3 66.15,12.2 68.35,0.7 85.6,3.5 85.8,30.7 85.8,29.1 85.9,21.9 85.9,16.2 85.9,11.85 85.9,11.05 61.6,0.7 83.05,10.4 80.2,13.4 81.3,27.9 79,27.9 77.05,13.4 50.4,16.7 73.9,28.3 77.55,10.4 85.8,29.9 85.2,31.1 83.4,14.3 74,13.4 68.8,23.7 72,23.7 65.65,23.4 68.8,26.1 60.7,12.7 63.8,19.7 67.5,27.5 67.5,28.7 59.7,10.7 56.1,10.1 53.1,12.5 52.7,17.1 59.8,16.9 52.3,25.7 63.75,12.55 31.2,14 29.8,14.85 33.2,15.35 33.2,18.05 75.85,27.5 60,21.5 62.9,20.1 74.3,25.8 53.4,20.7 29.8,32.05 34.6,32.05 38.2,32.05 34.2,29.65 33,26.65 29.8,28.25 29.8,23.05 29.8,18.85 35.8,20.85 36.8,26.65 36.2,31.05 32.95,31.25 31.2,28.25 44.4,32.1 50.6,32.1 49.6,30.5 55.6,32.25 45.2,30.5 47.6,28.1 38.85,30.6 42.4,16.9 36.8,22.45 37.55,24.4 60.2,23.85 57.9,26.1 55.5,26.1 65.15,26.75 68.8,27.5 37.8,28.6 47.6,26.3 41.6,28.5 42.4,25.7 46,24.3 50,24.3 60.6,32.25 73.6,32.1 36.4,13.9 38.2,13.9 59.1,1.85 53.7,1.85 56.4,1.85 56.4,3.65 59.1,4.05 53.7,4.05 51.9,4.05 60.7,5.25 71.45,4.55 73.3,4.95 73.2,2.65 70.45,2.95 63.25,4.75 63.2,8.35 56.15,18 42.1,7.3 45.3,10.25 51.25,10.75 49.45,8.55 49.45,7.75 49.45,9.3 50.45,10.75 47.15,10.25 49.65,10.75 51.25,11.75 75.95,0.7 72.55,0.7 79.95,0.7 82.75,0.7 33.2,9.7 32.4,8.7 48.6,0.7 74.9,4 77.85,8.7 85.85,7.55 44.4,16.9 61.7,22.45 31.2,9.7 31.2,9.1 31.2,7.9 29.8,5.3 68.8,16.5 40,13.9 70.95,10.25 85.9,12.65 65.65,32.1 68.8,19.3 68.8,21.9 65.5,18 83.6,26.85 78.35,32.15 80.85,7.95 80.7,9.35 85.6,32.1 59.8,19.3 67.75,13.05 59.8,17.9 55.6,15.7 29.8,0.9 34.8,0.9 39.6,0.7 33.8,13.5 35.8,11.9 37.6,7.9 35.2,5.3 51.3,0.65 43.5,0.65 56.9,30.55 61.4,28.55 60.7,26.65 60.3,30.65 67.7,30.7 68.4,32.1 64.35,21.65 71.3,25.7 80.05,31.4 84.45,7.55 63.6,25.05 76.7,3.6 81.1,3.8 74.9,5.4 72.1,6.9 70.7,9.3 69.1,8.2 66.9,8 65.7,5.5 70.8,5.75 61.3,7.7 58.3,8.3 55.3,7.5 65.15,8.4 66.55,9.8 68.75,10 76.5,5.8 74.9,8.8 74.5,10.2 76.5,7.6 40.6,2.7 42.6,2.7 41.6,2.7 40.4,1.7 42.8,1.7 46.2,0.7 45.5,4.3 46.5,2.5 45.5,2.5 43.5,3.9 43.5,6.1 39.9,7.3 39.4,9.3 39.4,11.7 42.6,12.3 43.4,14.1 45.6,15.7 49.4,15.7 51.8,14.3 48.45,4.95 49.45,4.95 49.45,6.75
  pour Top (isolate 0.2, rank 6, no thermals): 29.4,32.85 29.4,-0.3 86.4,-0.3 86.4,32.9
  pour Bottom (isolate 0.2, rank 6, no thermals): 29.4,32.85 29.4,-0.3 86.4,-0.3 86.4,32.9
  pour Route2 (isolate 0.4, rank 6, no thermals): 29.4,32.85 29.4,-0.3 86.4,-0.1 86.4,32.9
  pour Route15 (isolate 0.4, rank 6, no thermals): 29.4,32.85 29.4,-0.3 86.4,-0.1 86.4,32.9
PWR-LED
  Top 0.4: PGD.A R48.1
PWR-SNS
  Top 0.2: ESP1.5 80.23,30.73 80.65,31.15 80.65,32.15 R43.2 79.3,32.15 R44.1
RXD-B
  Top 0.2: OK1.6 31.7,20.85 R4.2
SD-DAT0
  Top 0.2: USD.7 48.8,26.3 49.2,25.9 50.4,25.9 51.6,27.1 53.8,27.1 54.45,27.75 R31.2
SD-DAT1
  Top 0.2: USD.8 49.9,27.5 53.5,27.5 54.15,28.15 RN3.3
SD-DAT2
  Top 0.2: USD.1 42.2,28.1 43.2,29.1 49.4,29.1 49.8,28.7 RN3.1 52.55,28.6
SD-DAT3
  Top 0.2: USD.2 43.3,28.2 43.8,28.7 49.2,28.7 49.6,28.3 51.65,28.3 52.05,27.9 53.15,27.9 53.35,28.1 RN3.2
SD-SCLK
  Top 0.2: USD.5 46.6,26.1 47.2,25.5 50.6,25.5 51.8,26.7 54,26.7 54.4,27.1 56.9,27.1 R33.2
SD-VCC  (via drill 0.3)
  Route15 1: v45.5,26.35 v45.5,28.1
  Route15 1.6: v36.35,15.25 v38.15,15.25 v39.75,15.25 39.75,20.45 45.5,26.2 v45.5,28.1
  pour Top (isolate 0.2, rank 2, no thermals): 34.85,15.85 34.65,15.65 34.65,14.85 34.85,14.65 39.85,14.65 40.05,14.85 40.05,15.45 39.65,15.85
  pour Top (isolate 0.2, rank 2, no thermals): 46,28.3 45.8,28.5 45.2,28.5 45,28.3 45,26.1 45.2,25.9 45.8,25.9 46,26.1
SUP-12V0
  Top 0.8: C20.1 26.65,11.2
  Top 1.2: C22.1 21.58,8.7
  Top 1.8: 26.65,11.2 26,11.2 25.5,10.7 22.6,10.7 21.58,9.68 21.58,8.7 21.58,8.15 | 16.6,8.15 21.58,8.15 | 21.58,8.15 DC1.1 | 12V.1 5.82,8.15 D1.C 16.6,8.15 | 16.6,8.15 C18.+
SUP-GND
  Top 0.8: C21.1 27.15,8.75 26.65,8.75
  Top 1.2: C22.2 24.12,8.7 24.12,8.5
  Top 1.8: 26.65,8.75 26.4,8.5 24.12,8.5 DC1.2 24.12,5.22 22.65,3.75 16.6,3.75 | 12V.2 5.62,4.15 D1.A 16.2,4.15 16.6,3.75 | C18.- 16.6,3.75
TVS-BSB-
  Top 0.3: R9.2 10.2,22 D3.1 13.65,21.75 D2.C
TXD-A
  Top 0.2: OK2.1 33.26,25.71 33.75,26.2 R3.2
TXD-B
  Top 0.2: Q2.B 33.85,24.75 34.35,25.25 35.4,25.25 35.8,25.65 35.8,27.8 R6.1
TXD-C
  Top 0.2: Q2.C 34.75,26.35 R3.1
UEXT-RX  (via drill 0.3)
  Top 0.2: v63.65,22.05 63.45,22.05 61.3,19.9 58.03,19.9 UEXT.4 56.83,18.7 55.9,18.7 55.6,18.4 54.2,18.4 53.9,18.1 53.9,15.5 53.5,15.1 53.5,13.7 54.3,12.9 55.5,12.9 56.1,12.3 56.1,11.1 56.9,10.3 58.3,10.3 59.1,11.1 59.1,11.8 60,12.7 60,13 60.5,13.5 61.3,13.5 61.5,13.3 RN4.4 | v77.4,28.5 77.69,28.79 ESP1.7
  Bottom 0.2: v77.4,28.5 76.85,28.5 76.45,28.1 75.4,28.1 71.8,24.5 65.3,24.5 64.45,23.65 64.45,22.85 v63.65,22.05
UEXT-TX  (via drill 0.3)
  Top 0.2: ESP1.9 75.15,28.7 v75.05,28.6 | UEXT.3 56.04,19.44 57.1,20.5 57.9,20.5 58.1,20.3 61.1,20.3 v63.85,23.05
  Bottom 0.2: v75.05,28.6 75.05,28.35 71.6,24.9 65.1,24.9 63.85,23.65 v63.85,23.05
USB-D_N
  Top 0.175: USB.D- 55.75,5.7 55.91,5.86 55.91,6.34 arc-90 57.04,7.46 60,7.46 arc-45 60.8,7.13 61.42,6.51 arc45 61.99,6.28 64.13,6.28 | IC6.2 72.8,4.28 72.71,4.36 72.71,4.95 arc45 72.38,5.75 71.6,6.53 arc-45 71.36,7.1 71.36,7.1 arc45 71.03,7.9 70.25,8.68 arc45 68.84,9.26 67.56,9.26 arc45 66.15,8.68 66.02,8.55 arc45 65.44,7.14 65.44,7.08 arc-90 64.64,6.28 64.13,6.28 | U2.1 64.13,6.28
  Top 0.2: USB.D- 55.75,4.75
USB-D_P
  Top 0.175: USB.D+ 56.4,5.7 56.24,5.86 56.24,6.34 arc-90 57.04,7.14 60,7.14 arc-45 60.57,6.9 61.22,6.26 arc45 62.01,5.93 64.13,5.93 | IC6.1 72.3,4.28 72.39,4.36 72.39,4.95 arc45 72.15,5.52 71.37,6.3 arc-45 71.04,7.1 71.04,7.1 arc45 70.8,7.67 70.02,8.45 arc45 68.84,8.94 67.56,8.94 arc45 66.38,8.45 66.25,8.32 arc45 65.76,7.14 65.76,7.05 arc-90 64.64,5.93 64.13,5.93 | U2.5 64.13,5.93
USB-VBUS
  Top 0.4: USB.VBUS 55.1,6.35 54.9,6.35
  Top 0.8: 54.9,6.35 54.5,6.75 54.35,6.75
  Top 1: 54.35,6.75 51.25,6.75 50.6,6.1 50.6,3.3 49.1,1.8 Q7.3

### Text on the board
tPlace: B+ | B- | BSB to WiFi / ESP32 Based | 1.5kV Max | Isolated / Supply | V+ | V- | T Carpenter / V1.1 Apr25
bPlace: JLCJLCJLC | Open / Hardware | Based on: / Olimex ESP32-POE-ISO / Fredlcore BSB-LAN | github://TCWORLD/BSB-Interface-PCBs